# EAGLE design Brain_V0_1 (EAGLE 7.3.0)
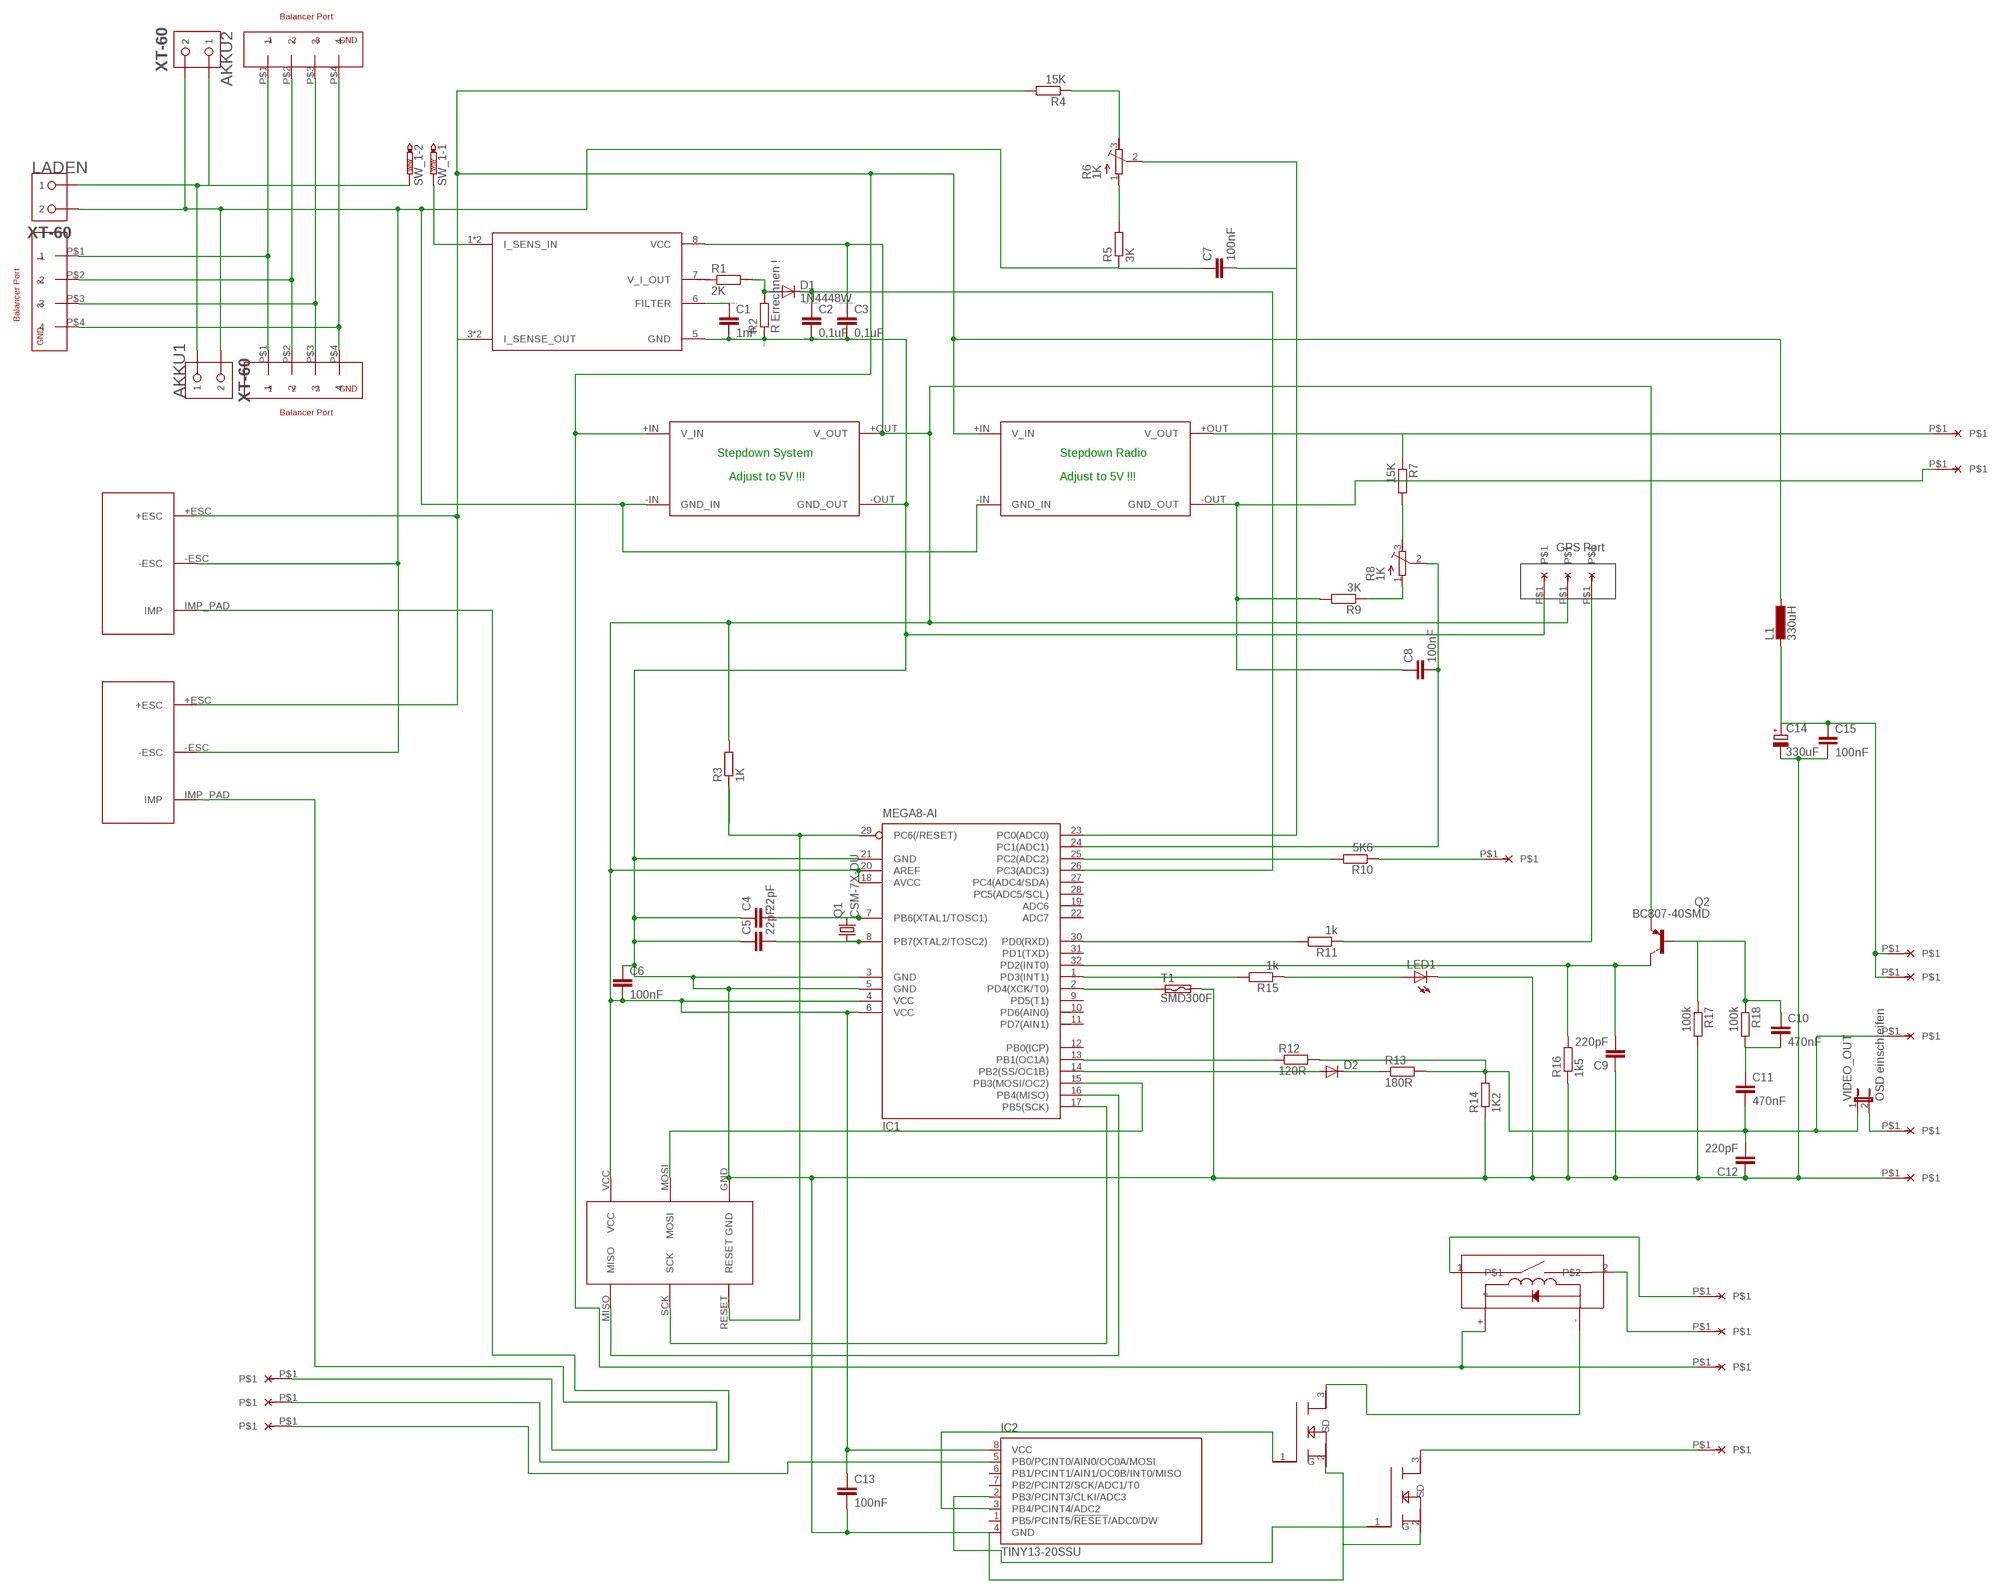
[diagram p0: schematic, sheet 1]

## Parts
5V_GPS  LöTPAD_KLEIN  [LöTPAD_KLEIN]
AKKU1  XT-60  [XT-60]
AKKU2  XT-60  [XT-60]
BALANCE_OUT  BALANCER_3S  [BALANCER_3S]
BALANCER_1  BALANCER_3S  [BALANCER_3S]
BALANCER_2  BALANCER_3S  [BALANCER_3S]
BEC+  LöTPAD_KLEIN  [LöTPAD_KLEIN]
BEC-  LöTPAD_KLEIN  [LöTPAD_KLEIN]
C1  1nF  C-EUC0603K  [C0603K]
C2  0,1uF  C-EUC0603K  [C0603K]
C3  0,1uF  C-EUC0603K  [C0603K]
C4  22pF  C-EUC0603K  [C0603K]
C5  22pF  C-EUC0603K  [C0603K]
C6  100nF  C-EUC0603K  [C0603K]
C7  100nF  C-EUC0603K  [C0603K]
C8  100nF  C-EUC0603K  [C0603K]
C9  220pF  C-EUC0603K  [C0603K]
C10  470nF  C-EUC1206  [C1206]
C11  470nF  C-EUC1206  [C1206]
C12  220pF  C-EUC0603K  [C0603K]
C13  100nF  C-EUC0603K  [C0603K]
C14  330uF  CPOL-EU153CLV-0807  [153CLV-0807]
C15  100nF  C-EUC0603K  [C0603K]
CAMERA_VIDEO  LöTPAD_KLEIN  [LöTPAD_KLEIN]
CH1_IN  LöTPAD_KLEIN  [LöTPAD_KLEIN]
CH2_IN  LöTPAD_KLEIN  [LöTPAD_KLEIN]
CH3_IN  LöTPAD_KLEIN  [LöTPAD_KLEIN]
D1  1N4448W  DIODE-SOD523  [SOD523]
D2  DIODE-DO-214AC  [DO-214AC]
ESC1  MOT_CONNECTOR  [MOT_CONNECTOR]
ESC2  MOT_CONNECTOR  [MOT_CONNECTOR]
FILTER  LöTPAD_KLEIN  [LöTPAD_KLEIN]
FILTER_  LöTPAD_KLEIN  [LöTPAD_KLEIN]
GND_GPS  LöTPAD_KLEIN  [LöTPAD_KLEIN]
GND_VIDEO  LöTPAD_KLEIN  [LöTPAD_KLEIN]
IC1  MEGA8-AI  [TQFP32-08]
IC2  TINY13-20SSU  [8S1]
IR_GND  LöTPAD_KLEIN  [LöTPAD_KLEIN]
IR_VCC  LöTPAD_KLEIN  [LöTPAD_KLEIN]
L1  330uH  L-EUWE-TPC  [POWER-CHOKE_WE-TPC]
LADEN  XT-60  [XT-60]
LED1  LEDCHIP-LED0603  [CHIP-LED0603]
Q1  CSM-7X-DU  [CSM-7X-DU]
Q2  BC807-40SMD  [SOT23-BEC]
R1  2K  R-EU_R0603  [R0603]
R2  R Errechnen !  R-EU_R0603  [R0603]
R3  1K  R-EU_R0603  [R0603]
R4  15K  R-EU_R0603  [R0603]
R5  3K  R-EU_R0603  [R0603]
R6  1K  R-TRIMM3103  [RTRIM3103]
R7  15K  R-EU_R0603  [R0603]
R8  1K  R-TRIMM3103  [RTRIM3103]
R9  3K  R-EU_R0603  [R0603]
R10  5K6  R-EU_R0603  [R0603]
R11  1k  R-EU_R0603  [R0603]
R12  120R  R-EU_R0603  [R0603]
R13  180R  R-EU_R0603  [R0603]
R14  1K2  R-EU_R0603  [R0603]
R15  1k  R-EU_R0603  [R0603]
R16  1k5  R-EU_R0603  [R0603]
R17  100k  R-EU_R0603  [R0603]
R18  100k  R-EU_R0603  [R0603]
RSSI_IN  LöTPAD_KLEIN  [LöTPAD_KLEIN]
RX_GPS  LöTPAD_KLEIN  [LöTPAD_KLEIN]
STEPDOWN_RADIO  STEPDOWN_MINI  [STEPDOWN_SMALL]
STEPDOWN_SYSTEM  STEPDOWN_MINI  [STEPDOWN_SMALL]
SW_1  PTR2  [P2-38-17]
T1  SMD300F  [SMD050F]
U$1  REED-RELAIS  [REED-RELAIS]
U$2  IRLM2502  [SOT23]
U$3  I_SENSE_IC  [SOIC8]
U$4  ICSP_6P  [ICSP_6P]
U$5  IRLM2502  [SOT23]
VCC_CAM  LöTPAD_KLEIN  [LöTPAD_KLEIN]
VCC_VTX  LöTPAD_KLEIN  [LöTPAD_KLEIN]
VIDEO  LöTPAD_KLEIN  [LöTPAD_KLEIN]
VIDEO_OUT  OSD einschleifen  JP1E  [JP1]

## Nets
N$1: AKKU1.BATT AKKU2.BATT LADEN.BATT SW_1.TP-2
N$2: AKKU1.GND AKKU2.GND C7.1 ESC1.-ESC ESC2.-ESC LADEN.GND R5.1 STEPDOWN_RADIO.-IN(GND_IN) STEPDOWN_SYSTEM.-IN(GND_IN)
N$3: BALANCE_OUT.P$1 BALANCER_1.P$1 BALANCER_2.P$1
N$4: BALANCE_OUT.P$2 BALANCER_1.P$2 BALANCER_2.P$2
N$5: BALANCE_OUT.P$4 BALANCER_1.P$4 BALANCER_2.P$4
N$6: SW_1.TP-1 U$3.1(I_SENS_IN) U$3.2(I_SENS_IN)
N$8: 5V_GPS.P$1 C3.1 C6.2 C13.1 IC1.4(VCC) IC1.6(VCC) IC1.18(AVCC) IC1.20(AREF) IC2.8(VCC) Q2.E R3.2 STEPDOWN_SYSTEM.+OUT(V_OUT) U$3.8(VCC) U$4.VCC
N$9: C4.2 IC1.7(PB6(XTAL1/TOSC1)) Q1.2
N$10: C1.1 U$3.6(FILTER)
N$11: R1.1 U$3.7(V_I_OUT)
N$12: D1.A R1.2 R2.2
N$13: C2.1 D1.C IC1.26(PC3(ADC3))
N$14: FILTER_.P$1 U$1.2
N$15: C5.2 IC1.8(PB7(XTAL2/TOSC2)) Q1.1
N$16: IC1.29(PC6(/RESET)) R3.1 U$4.RESET
N$17: IC1.15(PB3(MOSI/OC2)) U$4.MOSI
N$18: IC1.17(PB5(SCK)) U$4.SCK
N$19: R4.1 R6.3(E)
N$20: IC1.16(PB4(MISO)) U$4.MISO
N$21: R5.2 R6.1(A)
N$22: VIDEO.P$1 VIDEO_OUT.2
N$23: C7.2 IC1.23(PC0(ADC0)) R6.2(S)
N$24: R7.2 R8.3(E)
N$25: R8.1(A) R9.1
N$26: BEC-.P$1 C8.1 R9.2 STEPDOWN_RADIO.-OUT(GND_OUT)
N$27: C8.2 IC1.24(PC1(ADC1)) R8.2(S)
N$28: IC1.25(PC2(ADC2)) R10.2
N$29: R10.1 RSSI_IN.P$1
N$30: IC1.30(PD0(RXD)) R11.2
N$31: R11.1 RX_GPS.P$1
N$32: IC1.2(PD4(XCK/T0)) T1.1
N$33: IC1.13(PB1(OC1A)) R12.1
N$34: C11.2 C12.2 CAMERA_VIDEO.P$1 R12.2 R13.2 R14.2 VIDEO_OUT.1
N$35: D2.A IC1.14(PB2(SS/OC1B))
N$36: D2.C R13.1
N$37: IC1.1(PD3(INT1)) R15.2
N$38: LED1.A R15.1
N$39: CH1_IN.P$1 ESC2.IMP_PAD(IMP)
N$40: CH2_IN.P$1 ESC1.IMP_PAD(IMP)
N$41: CH3_IN.P$1 IC2.5(PB0/PCINT0/AIN0/OC0A/MOSI)
N$42: FILTER.P$1 U$1.1
N$43: ESC1.+ESC ESC2.+ESC IR_VCC.P$1 L1.1 R4.2 STEPDOWN_RADIO.+IN(V_IN) STEPDOWN_SYSTEM.+IN(V_IN) U$1.+ U$3.3(I_SENSE_OUT) U$3.4(I_SENSE_OUT)
N$52: C9.2 IC1.32(PD2(INT0)) Q2.C R16.2
N$54: C10.1 Q2.B R17.1 R18.1
N$55: BALANCE_OUT.P$3 BALANCER_1.P$3 BALANCER_2.P$3
N$56: C10.2 C11.1 R18.2
N$57: IC2.3(PB4/PCINT4/ADC2) U$2.1(G)
N$58: IC2.2(PB3/PCINT3/CLKI/ADC3) U$5.1(G)
N$59: U$1.- U$2.3(D)
N$60: IR_GND.P$1 U$5.3(D)
N$67: BEC+.P$1 R7.1 STEPDOWN_RADIO.+OUT(V_OUT)
N$68: C14.+ C15.1 L1.2 VCC_CAM.P$1 VCC_VTX.P$1
N$69: C1.2 C2.2 C3.2 C4.1 C5.1 C6.1 C9.1 C12.1 C13.2 C14.- C15.2 GND_GPS.P$1 GND_VIDEO.P$1 IC1.3(GND) IC1.5(GND) IC1.21(GND) IC2.4(GND) LED1.C R2.1 R14.1 R16.1 R17.2 STEPDOWN_SYSTEM.-OUT(GND_OUT) T1.2 U$2.2(S) U$3.5(GND) U$4.GND U$5.2(S)
Unconnected: IC1.9(PD5(T1)) IC1.10(PD6(AIN0)) IC1.11(PD7(AIN1)) IC1.12(PB0(ICP)) IC1.19(ADC6) IC1.22(ADC7) IC1.27(PC4(ADC4/SDA)) IC1.28(PC5(ADC5/SCL)) IC1.31(PD1(TXD)) IC2.1(PB5/PCINT5/!RESET!/ADC0/DW) IC2.6(PB1/PCINT1/AIN1/OC0B/INT0/MISO) IC2.7(PB2/PCINT2/SCK/ADC1/T0)

## Notes on the sheet
- Stepdown System | Stepdown Radio
- Adjust to 5V !!! | Adjust to 5V !!!
- GPS Port

## Library data of the parts
5V_GPS BEC+ BEC- CAMERA_VIDEO CH1_IN CH2_IN CH3_IN FILTER FILTER_ GND_GPS GND_VIDEO IR_GND IR_VCC RSSI_IN RX_GPS VCC_CAM VCC_VTX VIDEO = ZZ_Eigene Bauteiel:LöTPAD_KLEIN
AKKU1 AKKU2 LADEN = RoboJackets-Connectors:XT-60: XT-60 Power Connector Distributor: HobbyKing <http://www.hobbyking.com/hobbyking/store/RC_PRODUCT_SEARCH.asp?strSearch=xt-60>
BALANCE_OUT BALANCER_1 BALANCER_2 = ZZ_Eigene Bauteiel:BALANCER_3S
C1-C3 = resistor:C-EU: CAPACITOR, European symbol; SPICEPREFIX: C
C4-C13 C15 = rcl:C-EU: CAPACITOR, European symbol
C14 = rcl:CPOL-EU: POLARIZED CAPACITOR, European symbol
D1 D2 = diode:DIODE-: DIODE
ESC1 ESC2 = ZZ_Eigene Bauteile:MOT_CONNECTOR
IC1 = atmel:MEGA8: MICROCONTROLLER 8 Kbytes FLASH, 1 kbytes SRAM, 512 bytes EEPROM, USART, 6-channel 10 bit ADC, 2-channel 8 bit ADC Pin compatible with Atmega48, ATMega88, ATMega168 Source: avr.lbr; MPN: ATMEGA8-16AU; OC_FARNELL: 9171371; OC_NEWARK: 73M8863
IC2 = atmel:TINY13: 8-bit AVR Microcontroller with 1K Bytes In-System Programmable Flash Source: http://www.atmel.com/dyn/resources/prod_documents/2535S.pdf; MPN: ATTINY13-20SSU; OC_FARNELL: 1455133; OC_NEWARK: 58M3771
L1 = rcl:L-EU: INDUCTOR, European symbol
LED1 = led:LED: LED OSRAM: - CHIPLED LG R971, LG N971, LY N971, LG Q971, LY Q971, LO R971, LY R971 LH N974, LH R974 LS Q976, LO Q976, LY Q976 LO Q996 - Hyper CHIPLED LW Q18S LB Q993, LB Q99A, LB R99A - SideLED LS A670, LO A670, LY A670, LG A670, LP A670 LB A673, LV A673, LT A673, LW A673 LH A674 LY A675 LS A676, LA A676, LO A676, LY A676, LW A676 LS A679, LY A679, LG A679 - Hyper Micro SIDELED® LS Y876, LA Y876, LO Y876, LY Y876 LT Y87S - SmartLED LW L88C, LW L88S LB L89C, LB L89S, LG L890 LS L89K, LO L89K, LY L89K LS L896, LA L896, LO L896, LY L896 - TOPLED LS T670, LO T670, LY T670, LG T670, LP T670 LSG T670, LSP T670, LSY T670, LOP T670, LYG T670 LG T671, LOG T671, LSG T671 LB T673, LV T673, LT T673, LW T673 LH T674 LS T676, LA T676, LO T676, LY T676, LB T676, LH T676, LSB T676, LW T676 LB T67C, LV T67C, LT T67C, LS T67K, LO T67K, LY T67K, LW E67C LS E67B, LA E67B, LO E67B, LY E67B, LB E67C, LV E67C, LT E67C LW T67C LS T679, LY T679, LG T679 LS T770, LO T770, LY T770, LG T770, LP T770 LB T773, LV T773, LT T773, LW T773 LH T774 LS E675, LA E675, LY E675, LS T675 LS T776, LA T776, LO T776, LY T776, LB T776 LHGB T686 LT T68C, LB T68C - Hyper Mini TOPLED® LB M676 - Mini TOPLED Santana® LG M470 LS M47K, LO M47K, LY M47K Source: http://www.osram.convergy.de LUXEON: - LUMILED® LXK2-PW12-R00, LXK2-PW12-S00, LXK2-PW14-U00, LXK2-PW14-V00 LXK2-PM12-R00, LXK2-PM12-S00, LXK2-PM14-U00 LXK2-PE12-Q00, LXK2-PE12-R00, LXK2-PE12-S00, LXK2-PE14-T00, LXK2-PE14-U00 LXK2-PB12-K00, LXK2-PB12-L00, LXK2-PB12-M00, LXK2-PB14-N00, LXK2-PB14-P00, LXK2-PB14-Q00 LXK2-PR12-L00, LXK2-PR12-M00, LXK2-PR14-Q00, LXK2-PR14-R00 LXK2-PD12-Q00, LXK2-PD12-R00, LXK2-PD12-S00 LXK2-PH12-R00, LXK2-PH12-S00 LXK2-PL12-P00, LXK2-PL12-Q00, LXK2-PL12-R00 Source: www.luxeon.com KINGBRIGHT: KA-3528ASYC Source: www.kingbright.com
Q1 = crystal:CSM-7X-DU: SMD CRYSTAL Source: www.ecsxtal.com .. Crystal 3.6864MHz CSM_7X_DU.PDF; OC_FARNELL: unknown; OC_NEWARK: unknown
Q2 = transistor-pnp:BC807*: PNP Transistror
R1 R2 = resistor:R-EU_: RESISTOR, European symbol; SPICEPREFIX: R
R3-R5 R7 R9-R18 = rcl:R-EU_: RESISTOR, European symbol
R6 R8 = rcl:R-TRIMM: Trimm resistor
STEPDOWN_RADIO STEPDOWN_SYSTEM = ZZ_Eigene Bauteiel:STEPDOWN_MINI
SW_1 = testpad:PTR2: TEST PIN
T1 = switch-raychem:SMD*F: PolySwitch (TM) Resettable Device Source: Data sheet <http://www.farnell.com/datasheets/13482.pdf>
U$1 = ZZ_Eigene Bauteiel:REED-RELAIS
U$2 U$5 = ZZ_Eigene Bauteiel:IRLM2502
U$3 = ZZ_Eigene Bauteiel:I_SENSE_IC
U$4 = ZZ_Eigene Bauteiel:ICSP_6P
VIDEO_OUT = jumper:JP1E: JUMPER

## Board
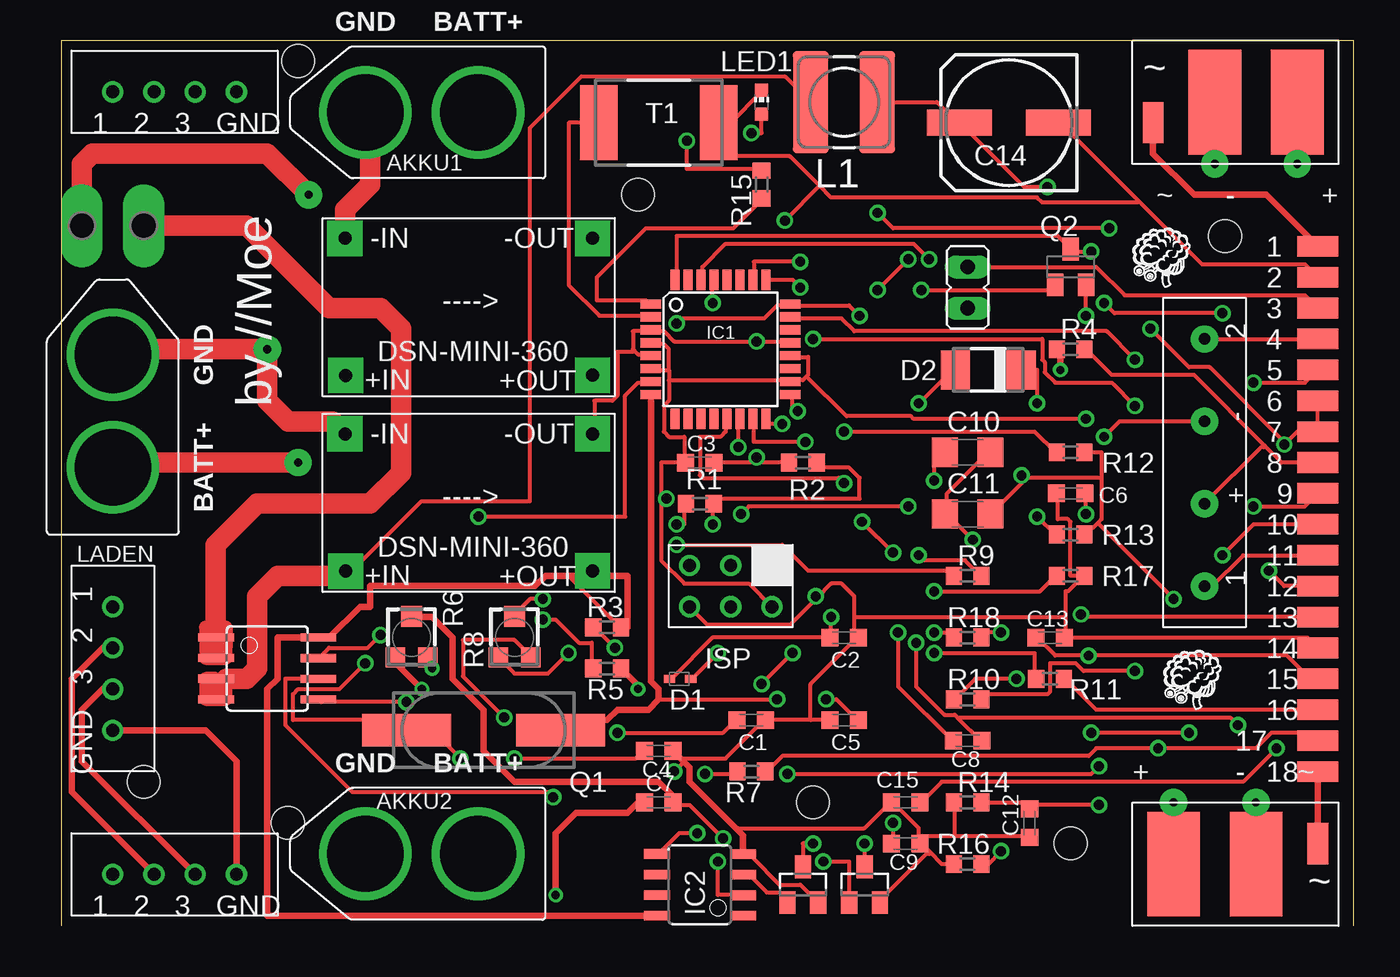
[diagram p1: board, top side]
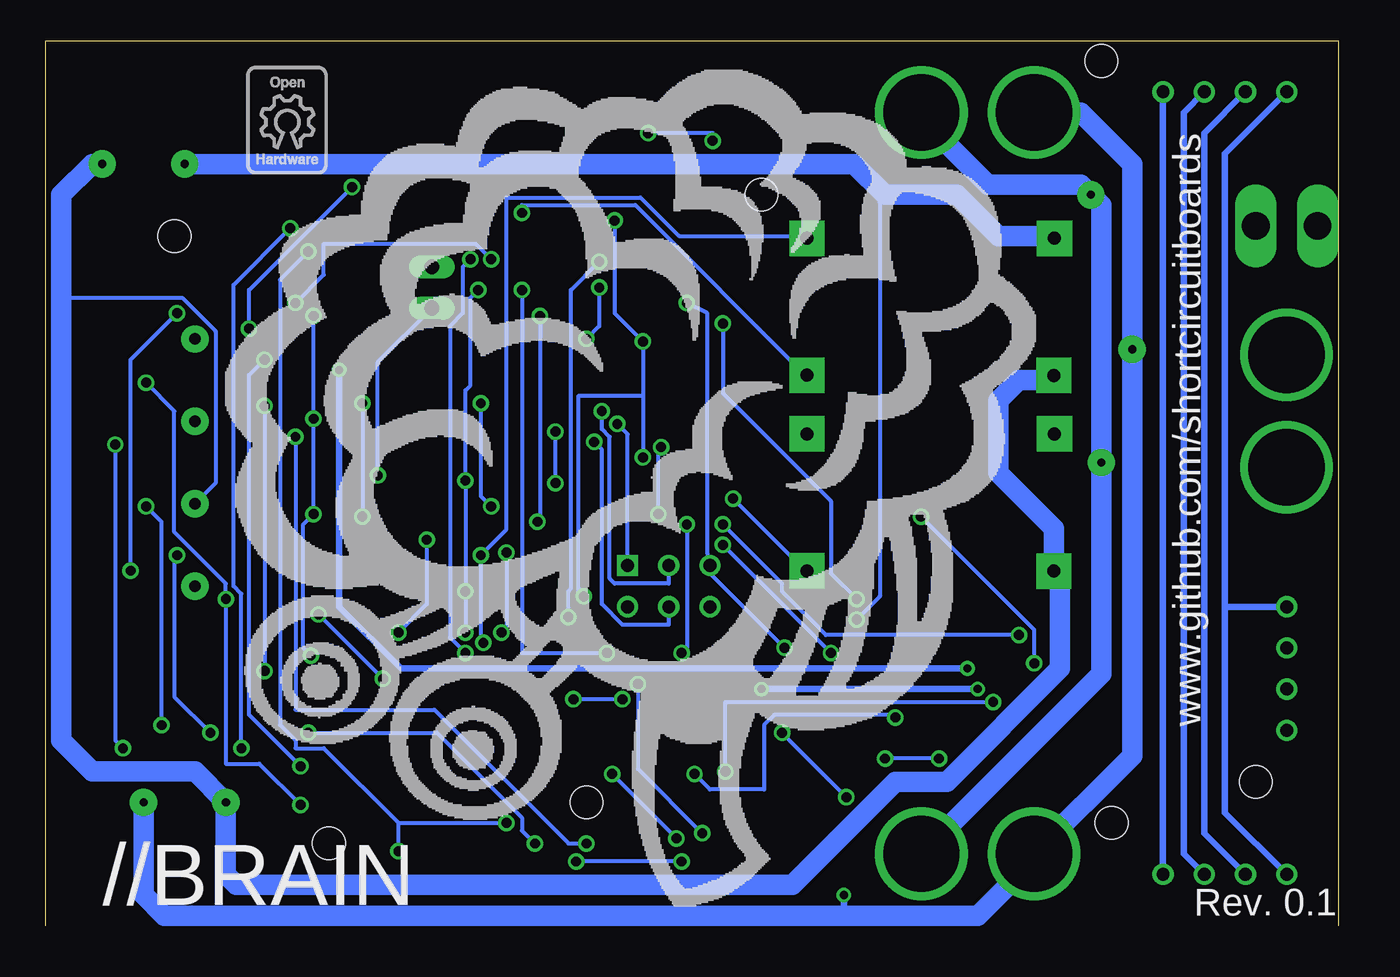
[diagram p2: board, bottom side, seen from below]

Size 79.68 x 54.6 mm. Coordinates in mm from the lower left corner, seen from the top.
Outline: 79.68,0 79.68,54.6 0,54.6 0,0
Copper layers (1*16): Top 0.035mm / dielectric 1.5mm / Bottom 0.035mm
Design rules "default *": minimum track width 10mil, minimum drill 24mil, track to track 8mil, track to pad 8mil, pad to pad 8mil, via to via 8mil, smd to smd 8mil, copper to edge 40mil, drill to drill 8mil, minimum pad ring 10mil, minimum via ring 8mil, stop-mask expansion 0mil, vias tented up to drill 550mil, thermal gap 10mil
Holes 2 mm at 71.75,42.54 13.97,6.35 5.08,8.89 35.56,45.09 62.23,5.08 46.35,7.62 14.61,53.34

### Footprints (pad centres in the part's own frame; a part is rotated, then mirrored left to right if it is on the bottom)
LöTPAD_KLEIN = smd 1.27 x 2.54: P$1 0,0
XT-60 = drill 4.7: BATT 0,4.154; GND 0,11.092
BALANCER_3S = drill 0.8: P$1 -3.81,1.27; P$2 -1.27,1.27; P$3 1.27,1.27; P$4 3.81,1.27
C0603K = smd 1.05 x 1.08: 1 -0.875,0; 2 0.875,0
C1206 = smd 1.6 x 1.8: 1 -1.4,0; 2 1.4,0
153CLV-0807 = smd 4 x 1.6: + 3.05,0; - -3.05,0
SOD523 = smd 0.7 x 0.5: A 0.7,0; C -0.6,0
DO-214AC = smd 1.8 x 2.4: A 2.025,0; C -2.025,0
MOT_CONNECTOR = smd 3.251 x 6.452: +ESC -12.7,3.81; -ESC -7.62,3.81 | smd 1.27 x 2.54: IMP_PAD -3.81,5.08
TQFP32-08 = smd 1.27 x 0.559: 1 -4.293,2.8; 2 -4.293,2; 3 -4.293,1.2; 4 -4.293,0.4; 5 -4.293,-0.4; 6 -4.293,-1.2; 7 -4.293,-2; 8 -4.293,-2.8; 17 4.293,-2.8; 18 4.293,-2; 19 4.293,-1.2; 20 4.293,-0.4; 21 4.293,0.4; 22 4.293,1.2; 23 4.293,2; 24 4.293,2.8 | smd 0.559 x 1.27: 9 -2.8,-4.293; 10 -2,-4.293; 11 -1.2,-4.293; 12 -0.4,-4.293; 13 0.4,-4.293; 14 1.2,-4.293; 15 2,-4.293; 16 2.8,-4.293; 25 2.8,4.293; 26 2,4.293; 27 1.2,4.293; 28 0.4,4.293; 29 -0.4,4.293; 30 -1.2,4.293; 31 -2,4.293; 32 -2.8,4.293
8S1 = smd 0.6 x 1.6: 1 -1.905,-2.654; 2 -0.645,-2.654; 3 0.625,-2.654; 4 1.895,-2.654; 5 1.905,2.654; 6 0.635,2.654; 7 -0.635,2.654; 8 -1.905,2.654
POWER-CHOKE_WE-TPC = smd 6.3 x 2.2: 1 0,2.05; 2 0,-2.05
CHIP-LED0603 = smd 0.8 x 0.8: A 0,-0.75; C 0,0.75
CSM-7X-DU = smd 5.5 x 2: 1 -4.75,0; 2 4.75,0
SOT23-BEC = smd 1 x 1.4: B -0.95,-1.1; C 0,1.1; E 0.95,-1.1
R0603 = smd 1 x 1.1: 1 -0.85,0; 2 0.85,0
RTRIM3103 = smd 1.2 x 1.25: 1 -1,-1.225; 3 1,-1.225 | smd 1.3 x 1.3: 2 0,1.3
STEPDOWN_SMALL = drill 0.8 pad 2.184 square: +IN -13.585,0.297; +OUT 1.637,0.303; -IN -13.622,8.752; -OUT 1.637,8.752
P2-38-17 = drill 1.702 pad 2.121 long: TP-1 -1.905,0; TP-2 1.905,0
SMD050F = smd 2.3 x 4.6: 1 -3.7,0; 2 3.7,0
REED-RELAIS = drill 0.7 pad 1.676: 1 -7.62,0; 2 7.62,0; + -2.54,0; - 2.54,0
SOT23 = smd 1 x 1.4: 1 -0.95,-1.1; 2 0.95,-1.1; 3 0,1.1
SOIC8 = smd 0.5 x 2.2: 1 -1.905,-3.154; 2 -0.645,-3.154; 3 0.625,-3.154; 4 1.895,-3.154; 5 1.905,3.154; 6 0.635,3.154; 7 -0.635,3.154; 8 -1.905,3.154
ICSP_6P = drill 0.8: GND 5.08,3.81; MOSI 2.54,3.81; RESET 5.08,1.27; SCK 2.54,1.27; VCC 0,3.81 | drill 0.8 square: MISO 0,1.27
JP1 = drill 0.914 long: 1 0,-1.27; 2 0,1.27

### Placement (x,y rotation side)
5V_GPS  77.47,15.24 90 top
AKKU1  29.84,50.16 90 top
AKKU2  29.84,4.45 90 top
BALANCE_OUT  1.91,15.88 270 top
BALANCER_1  6.99,50.16 0 top
BALANCER_2  6.99,1.91 0 top
BEC+  77.47,11.43 90 top
BEC-  77.47,26.67 90 top
C1  42.55,12.7 0 top
C2  48.26,17.78 0 top
C3  39.37,28.58 0 top
C4  36.83,10.8 180 top
C5  48.26,12.7 0 top
C6  62.23,26.67 0 top
C7  36.83,7.62 0 top
C8  55.88,11.43 180 top
C9  52.07,5.08 180 top
C10  55.88,29.21 0 top
C11  55.88,25.4 0 top
C12  59.69,6.35 90 top
C13  60.96,17.78 0 top
C14  58.42,49.53 180 top
C15  52.07,7.62 180 top
CAMERA_VIDEO  77.47,34.29 90 top
CH1_IN  77.47,9.52 90 top
CH2_IN  77.47,41.91 90 top
CH3_IN  77.47,20.95 90 top
D1  38.1,15.24 0 top
D2  57.15,34.29 180 top
E$1  [BRAINLOGO]  66.04,39.37 0 top
E$2  [BRAINLOGO]  67.94,13.34 0 top
E$3  [BRAINLOGO_BIG]  68.58,1.27 0 bottom
E$4  [OPEN_HARDWARE_SMALL]  67.31,46.35 0 bottom
ESC1  63.5,54.61 180 top
ESC2  81.28,0 0 top
FILTER  77.47,22.86 90 top
FILTER_  77.47,36.2 90 top
GND_GPS  77.47,17.15 90 top
GND_VIDEO  77.47,40.01 90 top
IC1  40.64,35.56 0 top
IC2  39.37,2.54 90 top
IR_GND  77.47,24.77 90 top
IR_VCC  77.47,28.58 90 top
L1  48.26,50.8 90 top
LADEN  3.17,24.13 0 top
LED1  43.18,50.8 0 top
Q1  26.04,12.07 180 top
Q2  62.23,40.64 0 top
R1  39.37,26.04 0 top
R2  45.72,28.58 0 top
R3  33.66,18.41 0 top
R4  62.23,35.56 0 top
R5  33.66,15.88 0 top
R6  21.59,17.78 0 top
R7  42.55,9.52 180 top
R8  27.94,17.78 0 top
R9  55.88,21.59 0 top
R10  55.88,13.97 0 top
R11  60.96,15.24 180 top
R12  62.23,29.21 0 top
R13  62.23,24.13 0 top
R14  55.88,7.62 0 top
R15  43.18,45.72 270 top
R16  55.88,3.81 0 top
R17  62.23,21.59 0 top
R18  55.88,17.78 0 top
RSSI_IN  77.47,19.05 90 top
RX_GPS  77.47,13.34 90 top
STEPDOWN_RADIO  31.11,33.66 0 top
STEPDOWN_SYSTEM  31.11,21.59 0 top
SW_1  3.17,43.18 180 top
T1  36.83,49.53 0 top
U$1  70.48,28.58 90 top
U$2  45.72,2.54 0 top
U$3  12.7,15.88 270 top
U$4  43.81,23.5 180 top
U$5  49.53,2.54 0 top
VCC_CAM  77.47,32.38 90 top
VCC_VTX  77.47,30.48 90 top
VIDEO  77.47,38.1 90 top
VIDEO_OUT  55.88,39.37 0 top

### Tracks (layer width: path | path; a pad name or v marks a point on that pad's centre or on a via)
N$1  (via drill 0.5 pad 1.68)
  Top 1.27: v14.61,28.58 3.47,28.58 LADEN.BATT | SW_1.TP-2 1.27,46.99 1.91,47.63 12.7,47.63 v15.24,45.09
  Bottom 1.27: AKKU1.BATT 25.69,49.82 21.59,45.72 15.88,45.72 v15.24,45.09 14.61,44.45 v14.61,28.58 14.61,15.53 AKKU2.BATT
N$2  (via drill 0.5 pad 0.41, 0.5 pad 1.68, 0.61)
  Top 0.254: v29.69,18.89 30.48,18.89 31.91,17.46 32.7,17.46 32.7,15.88 R5.1
  Top 0.406: C7.1 35.56,7.62 34.92,6.98 31.75,6.98 30.48,5.71 v30.48,1.91
  Top 1.27: LADEN.GND 3.51,35.56 v12.7,35.56 12.7,32.38 13.97,31.12 16.72,31.12 STEPDOWN_SYSTEM.-IN | STEPDOWN_RADIO.-IN 17.49,44.16 19.05,45.72 19.05,49.87 AKKU1.GND | ESC1.-ESC v71.12,46.99 | v73.66,7.62 ESC2.-ESC
  Bottom 0.254: v29.69,18.89 28.26,20.32 28.26,44.61 27.94,45.09
  Bottom 0.406: v30.48,1.91 30.48,0.64
  Bottom 1.27: AKKU1.GND 15.88,50.16 12.7,46.99 v12.7,35.56 12.7,10.5 AKKU2.GND 18.75,4.11 22.23,0.64 30.48,0.64 72.39,0.64 73.66,1.91 v73.66,7.62 | v71.12,46.99 29.84,46.99 27.94,45.09 23.5,45.09 20.95,42.54 17.63,42.54 STEPDOWN_RADIO.-IN
N$3
  Bottom 0.406: BALANCER_1.P$1 6.99,47.63 6.99,19.69 | 6.99,19.69 6.99,6.98 BALANCER_2.P$1 | BALANCE_OUT.P$1 6.99,19.69
N$4
  Top 0.406: BALANCE_OUT.P$2 2.54,17.15 0.64,15.24 0.64,8.26 BALANCER_2.P$2
  Bottom 0.406: BALANCER_2.P$2 8.26,5.71 8.26,48.9 BALANCER_1.P$2
N$5
  Top 0.406: BALANCE_OUT.P$4 8.89,12.07 10.79,10.16 BALANCER_2.P$4
  Bottom 0.406: BALANCER_1.P$4 BALANCER_2.P$4
N$6
  Top 0.406: U$3.2 9.55,17.12 9.53,17.15 8.89,17.78
  Top 0.813: 8.89,17.78 8.89,16.51 9.53,16.51 | 9.53,16.51 10.16,16.51 10.16,17.15 | 10.16,17.78 9.53,17.15 9.53,17.78 | 9.53,17.78 8.89,18.41 8.89,17.78 | 8.89,17.78 9.53,17.78 | 9.53,17.78 10.16,18.41 10.16,17.78 | 10.16,17.78 10.16,17.15 | 10.16,17.15 9.53,16.51 | U$3.1 U$3.2
  Top 1.27: SW_1.TP-1 11.43,43.18 16.51,38.1 19.68,38.1 20.95,36.83 20.95,27.94 19.05,26.04 12.06,26.04 9.53,23.5 9.53,17.8 U$3.1
N$8  (via drill 0.61)
  Top 0.254: R3.2 34.45,18.41 31.43,21.43 31.43,21.59 | 45.96,33.89 46.04,33.97 46.04,35.08 45.09,35.08 IC1.20 | 45.96,33.89 45.72,33.66 45.09,33.66 IC1.18 44.93,33.66 37.47,33.66 | 38.42,28.58 38.42,30.16 37.47,30.16 37.15,30.48 37.15,32.07 37.47,32.38 37.47,33.66 | 37.47,34.29 37.47,33.66 | 37.47,34.29 36.35,34.29 IC1.6 | 37.47,34.29 37.47,35.56 37.15,35.88 36.35,35.88 IC1.4 | U$4.VCC 42.39,21.11 38.42,21.11 36.99,22.54 36.99,26.35 | 36.99,26.35 36.99,28.58 38.42,28.58 | 38.42,28.58 C3.1 | 36.99,26.35 v37.31,26.35 | 5V_GPS.P$1 76.99,15.24 75.56,16.67 v63.34,16.67 61.28,16.67 60.17,17.78 C13.1 | v63.18,25.4 63.18,26.67 C6.2 | v63.18,37.62 Q2.E | 45.96,33.89 48.42,31.43 52.39,31.43 52.55,31.27 v63.18,31.27
  Top 0.406: 32.45,21.59 31.43,21.59 29.84,21.59 29.21,20.95 19.05,20.95 19.05,19.69 18.41,19.69 16.51,17.78 U$3.8 13.34,17.78 13.34,15.24 12.7,14.61 12.7,0.64 IC2.8 | 32.45,21.59 STEPDOWN_SYSTEM.+OUT | R3.2 34.92,18.41 34.92,21.59 32.45,21.59
  Bottom 0.254: v37.31,26.35 32.86,21.91 STEPDOWN_SYSTEM.+OUT | v63.34,16.67 63.82,17.15 63.82,24.77 v63.18,25.4 v63.18,31.27 v63.18,37.62
N$9  (via drill 0.61)
  Top 0.254: v27.94,10.32 35.4,10.32 35.88,10.8 C4.2 | v24.61,10.32 22.86,12.07 Q1.2 21.27,12.07 20.64,12.7 14.29,12.7 14.29,14.29 14.61,14.61 17.14,14.61 v18.73,16.19 | v25.72,25.24 34.77,25.24 34.77,32.7 35.56,33.5 36.2,33.5 IC1.7
  Bottom 0.254: v24.61,10.32 v27.94,10.32 | v25.72,25.24 18.73,18.26 v18.73,16.19
N$10  (via drill 0.61)
  Top 0.254: v34.29,11.91 40.8,11.91 41.59,12.7 C1.1 | v30.32,7.94 30,8.26 17.94,8.26 13.81,12.38 13.81,15.24 U$3.6
  Bottom 0.254: v30.32,7.94 v34.29,11.91
N$11  (via drill 0.61)
  Top 0.254: v37.94,24.77 38.42,24.77 38.42,26.04 R1.1 | v19.68,17.94 18.89,17.15 16.51,17.15 15.88,16.51 U$3.7
  Bottom 0.254: v37.94,24.77 34.29,21.11 34.29,20.64 31.59,17.94 v19.68,17.94
N$12  (via drill 0.61)
  Top 0.254: v40.48,16.83 38.89,15.24 D1.A | v40.16,24.77 40.16,26.04 R1.2 40.32,26.04 40.64,26.35 49.21,26.35 49.21,27.62 48.58,28.26 46.99,28.26 46.67,28.58 R2.2
  Bottom 0.254: v40.48,16.83 40.16,17.15 v40.16,24.77
N$13  (via drill 0.61)
  Top 0.254: D1.C 37.62,15.24 40.16,17.78 C2.1 47.47,17.78 v47.47,19.05 | v45.56,40.96 42.7,40.96 42.7,40.01 IC1.26
  Bottom 0.254: v45.56,40.96 47.31,39.21 47.31,20.8 47.47,20.64 v47.47,19.05
N$14
  Top 0.254: U$1.2 FILTER_.P$1
N$15  (via drill 0.61)
  Top 0.254: v47.15,13.97 47.78,13.97 49.05,12.7 C5.2 | 36.83,13.97 v44.13,13.97
  Top 0.406: IC1.8 36.35,15.09 36.83,14.61 36.83,13.97 36.2,13.34 34.29,13.34 33.66,12.7 31.42,12.7 Q1.1
  Bottom 0.254: v44.13,13.97 v47.15,13.97
N$16  (via drill 0.61)
  Top 0.254: v34.13,17.15 32.86,18.41 R3.1 | v40.16,38.42 40.16,39.85 IC1.29
  Bottom 0.254: v34.13,17.15 38.73,21.75 U$4.RESET 38.89,23.02 38.89,37.78 v40.16,38.42
N$17  (via drill 0.61)
  Top 0.254: v45.88,29.84 42.7,29.84 42.7,31.12 IC1.15
  Bottom 0.254: v45.88,29.84 45.4,29.37 45.4,19.84 44.13,18.57 41.27,18.57 U$4.MOSI
N$18  (via drill 0.61)
  Top 0.254: v45.4,31.75 45.09,31.75 45.09,32.7 IC1.17
  Bottom 0.254: v45.4,31.75 45.4,30.64 44.93,30.16 44.93,21.43 44.61,21.11 41.27,21.11 U$4.SCK
N$19  (via drill 0.5 pad 0.41)
  Top 0.406: R6.3 22.59,16.15 v22.86,15.88 | v61.59,34.29 61.59,35.34 R4.1
  Bottom 0.406: v22.86,15.88 57.78,15.88 61.59,19.69 v61.59,34.29
N$20  (via drill 0.61)
  Top 0.254: v44.45,30.96 43.66,30.96 43.5,31.12 IC1.16
  Bottom 0.254: v44.45,30.96 43.81,30.32 U$4.MISO
N$21  (via drill 0.5 pad 0.41)
  Top 0.406: R6.1 20.59,16.24 v22.23,14.61 | v35.56,14.61 35.56,14.82 R5.2
  Bottom 0.406: v22.23,14.61 v35.56,14.61
N$22
  Top 0.254: VIDEO.P$1 76.68,38.89 65.56,38.89 63.82,40.64 VIDEO_OUT.2
N$23  (via drill 0.61)
  Top 0.254: v66.2,34.93 64.45,36.67 48.9,36.67 48.1,37.47 45.09,37.47 IC1.23 | v63.98,9.84 63.5,9.37 v44.77,9.37 | v40.8,5.4 38.73,7.46 37.78,7.46 C7.2
  Top 0.406: C7.2 37.7,8.02 36.83,8.89 27.94,8.89 26.04,10.8 26.04,13.34 24.13,15.24 24.13,17.78 22.86,19.05 21.62,19.05 R6.2
  Bottom 0.254: v66.2,34.93 67.15,33.97 67.15,13.02 v63.98,9.84 | v40.8,5.4 v44.77,9.37
N$24  (via drill 0.61)
  Top 0.254: v39.69,9.37 41.43,9.37 41.59,9.52 R7.2 | v27.3,12.86 24.77,15.4 24.77,17.62 27.94,17.62 28.89,16.67 R8.3
  Bottom 0.254: v39.69,9.37 38.73,8.41 35.4,8.41 35.4,12.38 34.77,13.02 27.3,13.02 v27.3,12.86
N$25  (via drill 0.61)
  Top 0.254: v37.94,23.5 44.45,23.5 46.04,21.91 54.61,21.91 54.93,21.59 R9.1 | v31.27,16.83 30,15.56 27.94,15.56 26.99,16.51 R8.1
  Bottom 0.254: v31.27,16.83 v37.94,23.5
N$26  (via drill 0.61)
  Top 0.254: 55.32,12.78 55.09,13.02 54.45,13.02 52.7,14.76 v52.7,17.46 | 55.32,12.78 56.67,11.43 C8.1 | v52.86,22.86 53.18,22.54 55.72,22.54 56.67,21.59 R9.2 | BEC-.P$1 76.68,25.88 v73.5,25.88 | v72.55,12.38 72.07,12.86 55.4,12.86 55.32,12.78
  Bottom 0.254: v52.7,17.46 52.86,17.62 v52.86,22.86 51.28,24.45 51.28,44.93 43.02,44.93 40.64,42.54 32.86,42.54 STEPDOWN_RADIO.-OUT | v73.5,25.88 72.55,24.92 v72.55,12.38
N$27  (via drill 0.61)
  Top 0.254: v51.59,18.1 51.59,14.76 54.93,11.43 C8.2 | v49.37,24.92 v51.28,23.02 | v49.21,37.62 48.58,38.26 45.09,38.26 IC1.24 44.93,38.26 44.13,38.26 43.34,37.47 38.26,37.47 v37.94,37.15 | v29.69,20.16 28.89,20.16 27.94,19.21 R8.2
  Bottom 0.254: v51.59,18.1 51.28,18.41 v51.28,23.02 | v49.37,24.92 49.21,25.08 v49.21,37.62 | v29.69,20.16 31.27,21.75 31.27,26.19 37.94,32.86 v37.94,37.15
N$28  (via drill 0.61)
  Top 0.254: v66.2,15.72 63.02,15.72 62.55,16.19 60.96,16.19 60.96,14.45 60.8,14.29 57.15,14.29 56.83,13.97 R10.2 | v66.2,32.07 64.77,33.5 61.28,33.5 60.64,34.13 60.64,34.77 60.48,34.93 60.48,36.2 v46.35,36.2 | v45.56,39.37 45.09,39.85 43.5,39.85 IC1.25
  Bottom 0.254: v66.2,32.07 v66.2,15.72 | v46.35,36.2 45.56,36.99 v45.56,39.37
N$29  (via drill 0.61)
  Top 0.254: v58.9,15.24 56.36,15.24 55.09,13.97 R10.1 | v62.87,19.21 63.02,19.05 RSSI_IN.P$1
  Bottom 0.254: v62.87,19.21 v58.9,15.24
N$30  (via drill 0.61)
  Top 0.254: v53.82,16.83 60.01,16.83 60.01,15.24 R11.2 | v53.5,41.12 52.55,42.07 40.96,42.07 39.53,40.64 39.53,40.01 IC1.30
  Bottom 0.254: v53.82,16.83 54.77,17.78 54.77,36.99 53.98,37.78 53.98,40.64 v53.5,41.12
N$31
  Top 0.254: RX_GPS.P$1 63.82,13.34 61.91,15.24 R11.1
N$32
  Top 0.254: T1.1 31.27,49.53 31.27,39.53 33.18,37.62 36.2,37.62 IC1.2
N$33  (via drill 0.61)
  Top 0.254: v48.26,30.48 60.01,30.48 61.28,29.21 R12.1 | v48.26,27.3 47.94,27.62 39.53,27.62 39.37,27.78 39.37,30.16 40.64,30.16 40.96,30.48 40.96,31.12 IC1.13
  Bottom 0.254: v48.26,27.3 v48.26,30.48
N$34  (via drill 0.61)
  Top 0.254: R14.2 59.37,7.62 59.69,7.3 C12.2 59.69,7.46 v63.98,7.46 | 63.9,24.84 64.14,25.08 64.14,27.62 | 63.9,24.84 63.18,24.13 R13.2 | 64.14,27.62 64.14,29.21 R12.2 | 59.45,27.54 59.53,27.62 64.14,27.62 | 59.45,27.54 57.31,25.4 C11.2 | 63.9,24.84 v68.58,20.16 | CAMERA_VIDEO.P$1 76.68,33.5 v73.5,33.5 | 59.45,27.54 v59.21,27.78
  Bottom 0.254: v63.98,7.46 66.52,10 68.58,10 v68.58,20.16 68.58,21.11 71.75,24.29 71.75,31.75 v73.5,33.5 | VIDEO_OUT.1 59.21,34.77 v59.21,27.78
N$35  (via drill 0.61)
  Top 0.254: v41.75,29.53 41.75,31.12 IC1.14 | v41.91,25.4 42.39,25.88 v52.23,25.88 | v52.86,32.23 54.93,34.29 D2.A
  Bottom 0.254: v41.75,29.53 41.91,29.37 v41.91,25.4 | v52.23,25.88 52.86,26.51 v52.86,32.23
N$36  (via drill 0.61)
  Top 0.254: v60.17,25.24 61.28,24.13 R13.1 | v60.17,32.23 60.17,34.29 D2.C
  Bottom 0.254: v60.17,32.23 v60.17,25.24
N$37
  Top 0.254: R15.2 43.18,44.77 41.43,43.02 36.04,43.02 33.02,40.01 33.02,38.58 36.04,38.58 36.2,38.42 IC1.1
N$38  (via drill 0.61)
  Top 0.254: LED1.A 43.18,48.9 v42.55,48.9 | v38.58,48.42 38.58,46.67 43.18,46.67 R15.1
  Bottom 0.254: v42.55,48.9 38.58,48.9 v38.58,48.42
N$39
  Top 0.406: CH1_IN.P$1 ESC2.IMP_PAD
N$40
  Top 0.406: ESC1.IMP_PAD 67.31,47.63 69.85,45.09 74.3,45.09 CH2_IN.P$1
N$41  (via drill 0.61)
  Top 0.254: v39.21,5.71 38.1,5.71 36.83,4.45 IC2.5 | v45.09,16.83 v43.18,14.92 | v52.23,41.12 v50.32,39.21 | v64.29,38.42 64.93,37.78 v71.6,37.78 | v74.45,21.91 75.41,20.95 CH3_IN.P$1
  Bottom 0.254: v39.21,5.71 43.18,9.68 v43.18,14.92 | v45.09,16.83 50.32,16.83 v50.32,39.21 | v52.23,41.12 53.18,42.07 62.55,42.07 62.55,40.16 v64.29,38.42 | v71.6,37.78 74.45,34.93 v74.45,21.91
N$42
  Top 0.254: FILTER.P$1 72.87,22.86 70.96,20.95 U$1.1
N$43  (via drill 0.5 pad 1.68)
  Top 0.254: 74.22,29.61 75.25,28.58 IR_VCC.P$1 | 74.22,29.61 69.85,33.97 64.77,33.97 63.18,35.56 R4.2 | U$1.+ 73.98,29.53 74.14,29.53 74.22,29.61 | L1.1 46.2,50.8 44.61,52.39 32.07,52.39 28.89,49.21 28.89,26.19 22.23,26.19 18.1,22.07 STEPDOWN_SYSTEM.+IN
  Top 0.813: U$3.4 U$3.3 8.9,15.25 8.89,15.24 8.89,13.97 10.16,13.97 10.16,15.24
  Top 1.27: 10.16,15.24 11.43,15.24 12.06,15.88 12.06,20.32 13.34,21.59 17.23,21.59 STEPDOWN_SYSTEM.+IN | ESC2.+ESC v68.58,7.62 | ESC1.+ESC v76.2,46.99
  Bottom 0.254: U$1.+ 69.22,27.3 69.22,36.67 71.28,38.74 78.74,38.74
  Bottom 1.27: STEPDOWN_RADIO.+IN 17.83,33.66 19.68,33.66 20.95,32.38 20.95,27.94 17.53,24.52 STEPDOWN_SYSTEM.+IN 17.14,21.5 17.14,15.88 24.13,8.89 27.3,8.89 33.66,2.54 67.94,2.54 68.58,3.18 v68.58,7.62 70.48,9.52 76.83,9.52 78.74,11.43 78.74,38.74 78.74,45.09 76.83,46.99 v76.2,46.99
N$52  (via drill 0.61)
  Top 0.254: v51.28,6.35 51.28,5.08 C9.2 | v57.94,4.6 57.15,3.81 R16.2 | IC1.32 37.94,40.01 37.94,42.54 61.44,42.54 Q2.C 62.23,41.59 v63.5,41.59
  Bottom 0.254: 57.94,6.35 v51.28,6.35 | v57.94,4.6 57.94,6.35 | 57.94,6.35 62.55,10.95 64.29,10.95 64.29,11.43 65.25,12.38 65.25,39.85 v63.5,41.59
N$54  (via drill 0.61)
  Top 0.254: v53.82,18.1 54.61,18.1 54.93,17.78 R18.1 | v53.82,27.46 53.82,29.21 C10.1 | v53.82,20.64 60.33,20.64 61.28,21.59 R17.1 | v53.02,39.21 60.96,39.21 Q2.B
  Bottom 0.254: v53.82,18.1 v53.82,20.64 v53.82,27.46 53.82,33.02 53.5,33.34 53.5,38.74 v53.02,39.21
N$55
  Top 0.406: BALANCE_OUT.P$3 2.54,14.61 1.27,13.34 1.27,10.16 BALANCER_2.P$3
  Bottom 0.406: BALANCER_2.P$3 9.53,4.45 9.53,50.16 BALANCER_1.P$3
N$56  (via drill 0.61)
  Top 0.254: v57.94,18.1 57.15,18.1 56.83,17.78 R18.2 | 54.61,25.4 v56.2,23.81 | 54.61,25.4 54.61,26.67 57.15,29.21 C10.2 | 54.61,25.4 C11.1
  Bottom 0.254: v57.94,18.1 56.2,19.84 v56.2,23.81
N$57
  Top 0.254: U$2.1 44.77,1.59 44.29,2.06 43.5,2.06 42.55,3.02 42.07,3.02 IC2.3
N$58  (via drill 0.61)
  Top 0.254: v46.99,3.97 48.58,3.97 48.58,1.59 U$5.1 | v40.48,3.97 40.48,1.91 41.91,1.91 IC2.2
  Bottom 0.254: v40.48,3.97 v46.99,3.97
N$59  (via drill 0.61)
  Top 0.254: U$2.3 45.72,5.08 v46.35,5.08 | v64.29,30.16 65.25,31.12 U$1.-
  Bottom 0.254: v46.35,5.08 47.47,5.08 55.72,13.34 64.29,13.34 v64.29,30.16
N$60  (via drill 0.61)
  Top 0.254: v49.53,5.08 U$5.3 | v69.53,11.91 v63.5,11.91 | v71.6,22.86 73.5,24.77 IR_GND.P$1
  Bottom 0.254: v49.53,5.08 50.32,5.87 50.32,6.67 55.56,11.91 v63.5,11.91 | v69.53,11.91 71.75,14.13 71.75,22.7 v71.6,22.86
N$67  (via drill 0.61)
  Top 0.254: BEC+.P$1 76.99,11.91 74.61,11.91 73.66,10.95 v67.63,10.95 63.82,10.95 63.34,10.48 44.45,10.48 43.5,9.52 R7.1 | v50.32,43.97 51.28,43.02 v64.61,43.02
  Bottom 0.254: v50.32,43.97 50.32,44.45 43.34,44.45 32.86,33.97 STEPDOWN_RADIO.+OUT | v64.61,43.02 68.1,39.53 68.1,20.95 67.63,20.48 v67.63,10.95
N$68  (via drill 0.61)
  Top 0.254: L1.2 53.98,50.8 55.24,49.53 C14.+ 55.4,49.53 59.37,45.56 v60.8,45.56 | v74.93,10.95 72.87,8.89 54.29,8.89 53.02,7.62 C15.1 | VCC_CAM.P$1 VCC_VTX.P$1 76.2,30.48 v75.41,29.69 75.41,29.84 70.8,34.45 69.53,34.45 v67.15,36.83
  Bottom 0.254: v74.93,10.95 75.41,11.43 v75.41,29.69 | v60.8,45.56 67.15,39.21 v67.15,36.83
N$69  (via drill 0.61)
  Top 0.254: R2.1 42.86,28.58 | 42.86,28.58 C3.2 | 35.32,35.48 35.24,35.56 35.24,36.67 36.2,36.67 IC1.3 36.35,36.67 37.15,36.67 37.78,36.04 v42.86,36.04 44.93,36.04 IC1.21 | 35.32,35.48 35.56,35.24 36.2,35.24 IC1.5 | v42.86,28.89 42.86,28.58 | STEPDOWN_SYSTEM.-OUT 32.86,30.48 32.86,32.38 33.97,32.38 34.29,32.7 34.29,35.4 35.24,35.4 35.32,35.48 | LED1.C 43.18,51.43 41.27,49.53 T1.2 41.43,49.53 41.43,47.47 44.93,47.47 46.75,45.64 | GND_VIDEO.P$1 76.68,40.8 70.33,40.8 66.44,44.69 | 66.44,44.69 61.59,49.53 C14.- | 46.75,45.64 47.47,44.93 60.17,44.93 60.48,44.61 66.36,44.61 66.44,44.69 | 46.75,45.64 v44.61,43.5 | 61.91,19.05 61.91,20.64 62.07,20.64 63.02,21.59 R17.2 62.23,21.59 62.23,24.92 62.07,25.08 61.44,25.08 61.44,26.67 C6.1 | 61.91,19.05 61.91,17.78 | GND_GPS.P$1 76.83,17.78 61.91,17.78 | 61.91,17.78 C13.2 | C5.1 46.2,12.7 | 46.2,12.7 C1.2 43.34,12.7 40.96,10.32 38.42,10.32 38.3,10.2 | 46.2,12.7 46.2,14.92 49.05,17.78 C2.2 48.9,17.78 48.9,19.05 | U$4.GND 39.85,18.57 44.93,18.57 46.59,20.24 | 46.59,20.24 47.47,21.11 48.1,21.11 48.9,20.32 48.9,19.05 | 53.58,4.52 54.29,3.81 R16.1 | 53.58,4.52 53.02,5.08 C9.1 | 52.86,5.56 52.86,5.08 C9.1 | 52.86,5.56 52.86,6.03 51.28,7.62 C15.2 51.12,7.62 49.53,6.03 41.75,6.03 41.67,5.95 | 52.86,5.56 55.09,5.56 | 55.09,5.56 59.69,5.56 C12.1 | 52.86,5.56 C9.1 | 55.09,5.56 55.09,7.62 R14.1 | U$5.2 50.48,1.59 53.34,4.45 53.5,4.45 53.58,4.52 | U$2.2 46.51,1.59 45.56,2.54 44.29,2.54 42.55,4.29 42.07,4.29 IC2.4 | v21.27,13.81 16.03,13.81 15.88,13.97 U$3.5 | 38.38,10.12 v37.78,9.52 | 48.9,19.05 61.91,19.05 | v46.51,20.32 46.59,20.24
  Top 0.406: IC2.4 42.02,5.6 41.67,5.95 38.73,8.89 38.73,9.77 38.38,10.12 38.3,10.2 C4.1
  Bottom 0.254: 42.86,32.7 v42.86,36.04 44.61,37.78 v44.61,43.5 | 42.86,32.7 v42.86,28.89 | v21.27,13.81 37.78,13.81 v37.78,9.52 | 42.86,32.7 46.83,32.7 46.83,20.64 v46.51,20.32

### Text on the board
tNames: ~ | by //Moe | 1 | 2 | 3 | 4 | 5 | 6 | 7 | 8 | 9 | 10 | 11 | 12 | 13 | 14 | 15 | 16 | 17 | 18 | ~
bNames: www.github.com/shortcircuitboards | //BRAIN | Rev. 0.1